# Altium schematic sheet AnalogConnector.SchDoc
size A4; CompanyName: Technische Hochschule Nürnberg Georg Simon Ohm; Organization: UltraZohm; Address1: Kesslerplatz 12; Address2: 90489 Nürnberg; Address3: GERMANY; DocumentNumber: 3; SheetNumber: 3; SheetTotal: 3; Website: www.ultrazohm.com
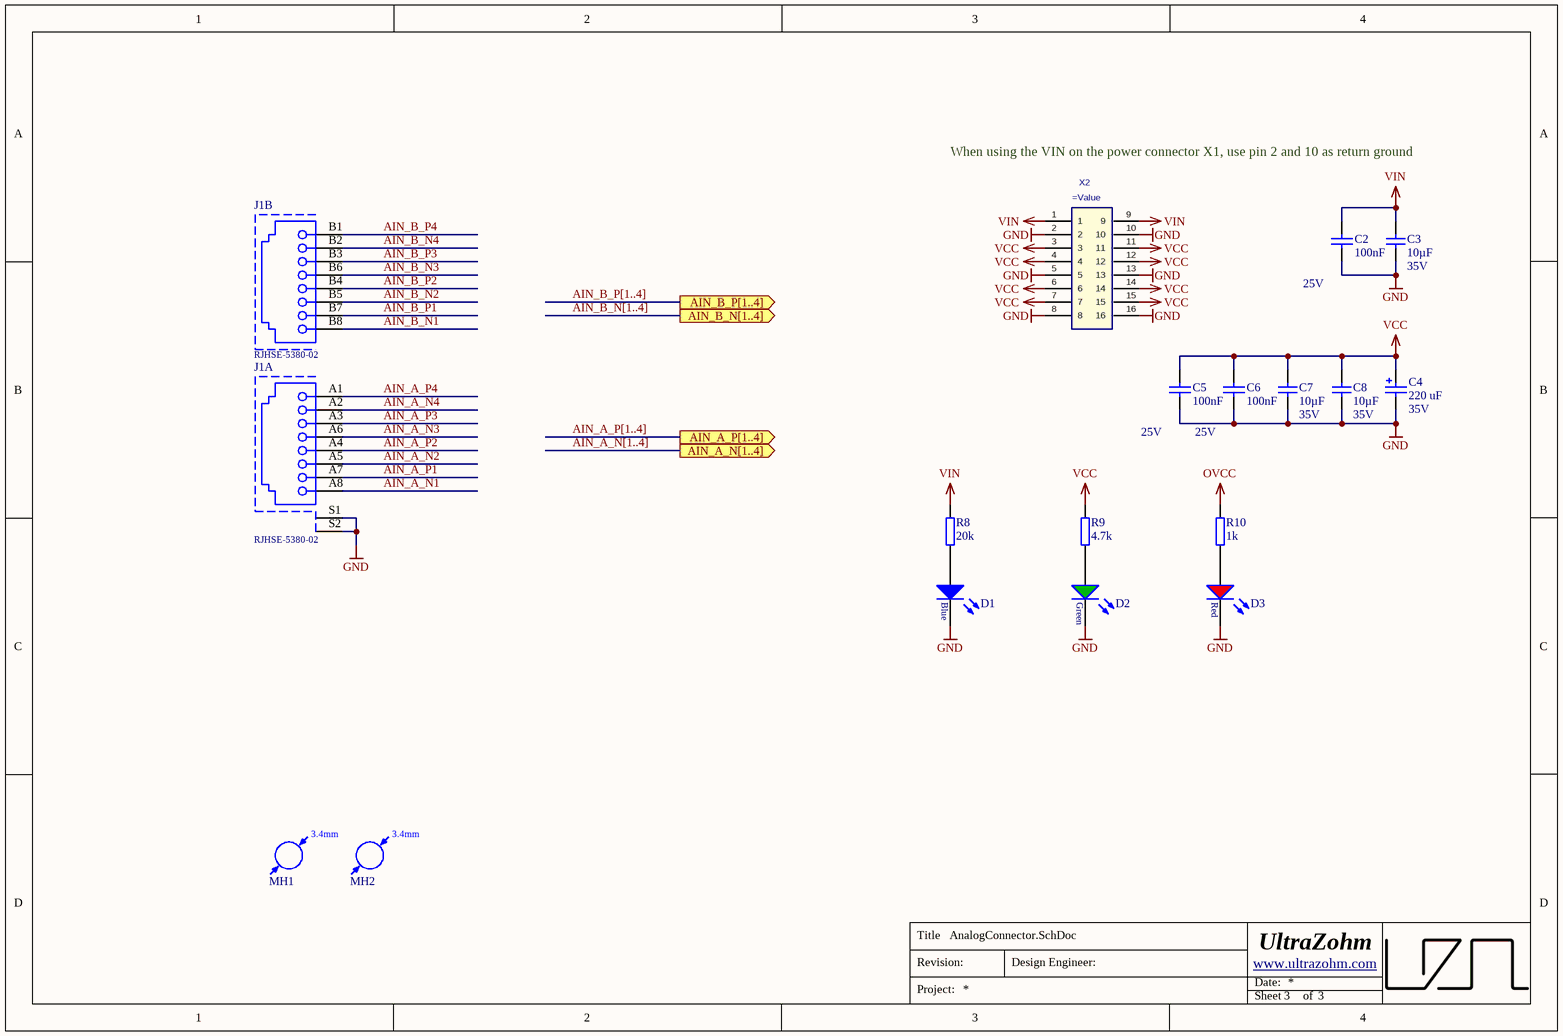
[diagram p0: AnalogConnector.SchDoc]

## Parts
C2  100nF  Voltage: 25V  [CAPC1608X07N]
C3  10µF  Voltage: 35V  [C_1206]
C4  220 uF  Voltage: 35V  [WCAP-ATG5_8x11.5x3.5]
C5  100nF  Voltage: 25V  [CAPC1608X07N]
C6  100nF  Voltage: 25V  [CAPC1608X07N]
C7  10µF  Voltage: 35V  [C_1206]
C8  10µF  Voltage: 35V  [C_1206]
D1  150060BS75000  [WL-SMCW_0603]  (value not drawn)
D2  150060GS75000  [WL-SMCW_0603]  (value not drawn)
D3  150060RS75000  [WL-SMCW_0603]  (value not drawn)
J1  RJHSE-5380-02  [RJHSE-5380-02]  (parts A,B of 2)
MH1  mounting hole 3,4mm  [MH_3.4]  (value not drawn)
MH2  mounting hole 3,4mm  [MH_3.4]  (value not drawn)
R8  20k  [RESC1608X06N]
R9  4.7k  [RESC1608X06N]
R10  1k  [RESC1608X06N]
X2  (no value)  [IPL1-108-01-L-D-RA-K]

## Ports
AIN_A_N[1..4] (out), AIN_A_P[1..4] (out), AIN_B_N[1..4] (out), AIN_B_P[1..4] (out)

## Nets
GND: C2.1 C3.1 C4.2(N) C5.1 C6.1 C7.1 C8.1 D1.1(K) D2.1(K) D3.1(K) J1.S1 J1.S2 X2.2 X2.5 X2.8 X2.10 X2.13 X2.16
OVCC: R10.2
VCC: C4.1(P) C5.2 C6.2 C7.2 C8.2 R9.2 X2.3 X2.4 X2.6 X2.7 X2.11 X2.12 X2.14 X2.15
VIN: C2.2 C3.2 R8.2 X2.1 X2.9
AIN_A_N1: J1.A8
AIN_A_N2: J1.A5
AIN_A_N3: J1.A6
AIN_A_N4: J1.A2
AIN_A_P1: J1.A7
AIN_A_P2: J1.A4
AIN_A_P3: J1.A3
AIN_A_P4: J1.A1
AIN_B_N1: J1.B8
AIN_B_N2: J1.B5
AIN_B_N3: J1.B6
AIN_B_N4: J1.B2
AIN_B_P1: J1.B7
AIN_B_P2: J1.B4
AIN_B_P3: J1.B3
AIN_B_P4: J1.B1
NetD1_2: D1.2(A) R8.1
NetD2_2: D2.2(A) R9.1
NetD3_2: D3.2(A) R10.1

## Buses and harness runs
bus AIN_A_N[1..4] = port AIN_A_N[1..4]
bus AIN_A_P[1..4] = port AIN_A_P[1..4]
bus AIN_B_N[1..4] = port AIN_B_N[1..4]
bus AIN_B_P[1..4] = port AIN_B_P[1..4]

## Notes on the sheet
- When using the VIN on the power connector X1, use pin 2 and 10 as return ground
- Title
- Revision:
- Design Engineer:
- Date:
- Project:
- Sheet
- of
- (in symbol Mounting Hole) 3.4mm

## Library data of the parts
C2 C5 C6 = Cap_0603: MPN: 885012206071; MF: Würth; Dielectric: X7R; Value: 100nF; Supplier 1: Mouser; Supplier 2: *; Supplier Part Number 1: 710-885012206071; Supplier Part Number 2: *; Package: 0603
C3 C7 C8 = C_1206: Capacitor 1206; MPN: GRM319R6YA106KA12D; Tolerance: 10%; MF: Murata Electronics; Dielectric: X5R; Package: 1206; Value: 10µF; Created: 2018_06_25_AGeiger; Supplier 1: Mouser; Supplier Part Number 1: 81-GRM319R6YA106KA2D
C4 = 860020574012: WCAP-ATG5 Aluminum Electrolytic Capacitors, 8x11.5mm, 35 Vdc, 220 uF; MF: Wurth Elektronik; ComponentLink1Description: Manufacturer; ComponentLink1URL: http://www.we-online.de; ComponentLink2Description: Datasheet; ComponentLink2URL: http://katalog.we-online.com/pbs/datasheet/860020574012.pdf; Part Number: 860020574012; Published Date: Sep. 2017; Size: 8x11.5mm; Life Cycle: 2000h; Operating Temperature: -40 °C up to +105 °C; Value: 220 uF; MPN: 860020574012; Supplier 1: Mouser; Supplier Part Number 1: 710-860020574012
D1 = LED_Blue_0603: WL-SMCW SMD Mono-color Chip LED Waterclear, size 0603, Blue, 3.2 V, 140°; Forward Voltage: 3.2 V; Luminous Intensity: 145 mcd; Peak Wavelength: 465 nm; Dominant Wavelength: 470 nm; MF: Wuerth Elektronik; Published Date: Sep. 2017; ComponentLink1Description: Manufacturer; ComponentLink1URL: http://www.we-online.de; ComponentLink2Description: Datasheet; ComponentLink2URL: http://katalog.we-online.com/led/datasheet/150060BS75000.pdf; MPN: 150060BS75000; Size: 0603; Viewing Angle: 140°; Emitting Color: Blue; Value: 150060BS75000; Package: 0603; Created: 2018_09_06_AGeiger; Supplier 1: Farnell; Supplier Part Number 1: 2322069; Supplier 2: Mouser; Supplier Part Number 2: 710-150060BS75000; Supplier 3: Digi-Key; Supplier Part Number 3: 732-4966-1-ND
D2 = LED_Green_0603: WL-SMCW SMD Mono-color Chip LED Waterclear, size 0603, Green, 3.2 V, 140°; Forward Voltage: 3.2 V; Luminous Intensity: 430 mcd; Peak Wavelength: 515 nm; Dominant Wavelength: 520 nm; MF: Wuerth Elektronik; Published Date: Sep. 2017; ComponentLink1Description: Manufacturer; ComponentLink1URL: http://www.we-online.de; ComponentLink2Description: Datasheet; ComponentLink2URL: http://katalog.we-online.com/led/datasheet/150060GS75000.pdf; MPN: 150060GS75000; Size: 0603; Viewing Angle: 140°; Emitting Color: Green; Value: 150060GS75000; Package: 0603; Created: 2018_09_06_AGeiger; Supplier 1: Farnell; Supplier Part Number 1: 2322070; Supplier 2: Mouser; Supplier Part Number 2: 710-150060GS75000; Supplier 3: Digi-Key; Supplier Part Number 3: 732-4971-1-ND
D3 = LED_Red_0603: WL-SMCW SMD Mono-color Chip LED Waterclear, size 0603, Red, 2 V, 140°; Forward Voltage: 2 V; Luminous Intensity: 250 mcd; Peak Wavelength: 630 nm; Dominant Wavelength: 625 nm; MF: Wuerth Elektronik; Published Date: Sep. 2017; ComponentLink1Description: Manufacturer; ComponentLink1URL: http://www.we-online.de; ComponentLink2Description: Datasheet; ComponentLink2URL: http://katalog.we-online.com/led/datasheet/150060RS75000.pdf; MPN: 150060RS75000; Size: 0603; Viewing Angle: 140°; Emitting Color: Red; Value: 150060RS75000; Package: 0603; Created: 2018_09_06_AGeiger; Supplier 1: Farnell; Supplier Part Number 1: 2322071; Supplier 2: Mouser; Supplier Part Number 2: 710-150060RS75000; Supplier 3: Digi-Key; Supplier Part Number 3: 732-4978-1-ND
J1 = RJHSE-5380-02: Modular Jack WR-MJ, Tab Up, Shielded, Dual Port, Righ Angle, THT, 8P8C; MF: Amphenol; Port: 1x2; Entrance: Right Angle; Compliance: Lead free / RoHS; Rated Current: 1.5 A; Working Voltage: 120 VAC; Withstanding Voltage: 1000 VAC; Contact Resistance: 20 mOhm; ComponentLink1Description: Manufacturer; ComponentLink1URL: http://www.we-online.de; ComponentLink2Description: Datasheet; ComponentLink2URL: https://katalog.we-online.de/em/datasheet/615016137621.pdf; MPN: RJHSE-5380-02; Published Date: July 2018; Pin Number: 8P8C; Operating Temperature: -40 to 85 degC; Mounting Technology: THT; Packaging: Tray; Supplier 1: Mouser; Supplier Part Number 1: 523-RJHSE-5380-02
MH1 MH2 = Mounting Hole: Non plated through hole, 3.4mm
R8 = R_0603: MPN: CRCW060320K0JNEAC; MF: Vishay / Dale; Value: 20k; Supplier 1: Mouser; Supplier Part Number 1: 71-CRCW060320K0JNEAC; Package: 0603
R9 = R_0603: MPN: CRCW06034K70JNEAC; MF: Vishay / Dale; Value: 4.7k; Supplier 1: Mouser; Supplier Part Number 1: 71-CRCW06034K70JNEAC; Package: 0603
R10 = R_0603: MPN: CRCW06031K00JNEAC; MF: Vishay / Dale; Value: 1k; Supplier 1: Mouser; Supplier Part Number 1: 71-CRCW06031K00JNEAC; Package: 0603
X2 = IPL1-108-XX-X-D-X: 2.54mm Double Row Terminal Assembly; MF: SAMTEC; Created: 2018_09_17_AGeiger; Value: =MPN; MPN: IPL1-108-01-L-D-RA-K; Supplier 1: Mouser; Supplier Part Number 1: 200-IPL110801LDRAK